# EAGLE design Qduino_Mini (EAGLE 7.3.0)
DESIGNER: Quin from Qtechknow; VERSION: v02
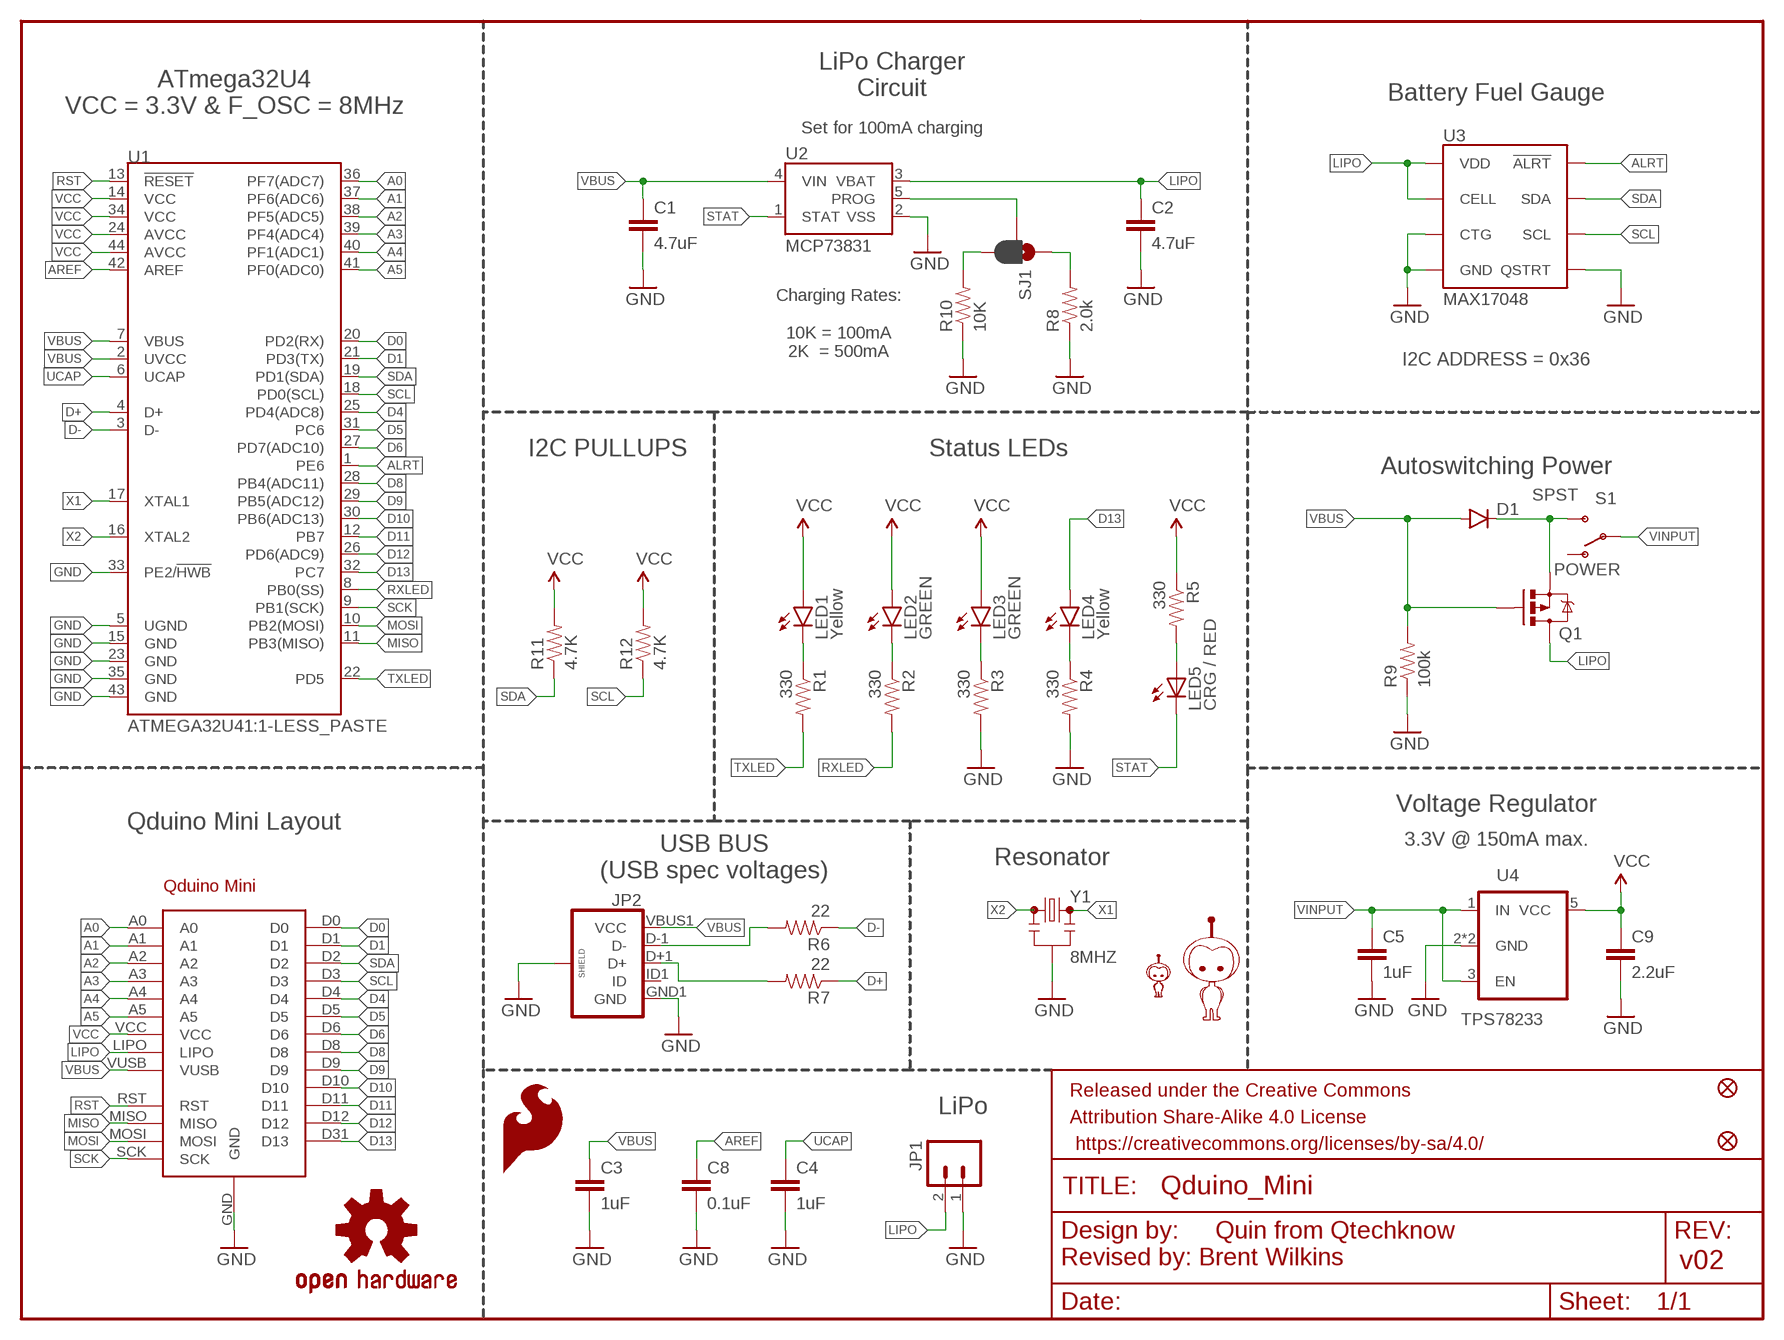
[diagram p0: schematic, sheet 1]

## Parts
C1  4.7uF  CAP0603-CAP  [0603-CAP]
C2  4.7uF  CAP0603-CAP  [0603-CAP]
C3  1uF  CAP0603-CAP  [0603-CAP]
C4  1uF  CAP0603-CAP  [0603-CAP]
C5  1uF  CAP0603-CAP  [0603-CAP]
C8  0.1uF  0.1UF-25V(+80/-20%)(0603)  [0603-CAP]
C9  2.2uF  2.2UF-10V-20%(0603)  [0603-CAP]
D1  250mA/100V  DIODEBAS16  [SOD-323]
FID5  FIDUCIAL1X2  [FIDUCIAL-1X2]
FID6  FIDUCIAL1X2  [FIDUCIAL-1X2]
FRAME2  FRAME-LETTER  [CREATIVE_COMMONS]
JP1  LiPo  M02-JST-2MM-SMT  [JST-2-SMD]
JP2  USB_MICROB_PLUGCONN-11752  [USB-B-MICRO-SMD_V03]
LED1  Yellow  LED-YELLOW0603  [LED-0603]
LED2  GREEN  LED-GREEN0603  [LED-0603]
LED3  GREEN  LED-GREEN0603  [LED-0603]
LED4  Yellow  LED-YELLOW0603  [LED-0603]
LED5  CRG / RED  LED0603  [LED-0603]
LOGO1  OSHW-LOGOS  [OSHW-LOGO-S]
LOGO2  SFE_LOGO_FLAME.1_INCH  [SFE_LOGO_FLAME_.1]
Q1  PFET  MOSFET-PCHANNEL  [SOT23-3]
R1  330  RESISTOR0603  [0603-RES]
R2  330  RESISTOR0603  [0603-RES]
R3  330  RESISTOR0603  [0603-RES]
R4  330  RESISTOR0603  [0603-RES]
R5  330  RESISTOR0603  [0603-RES]
R6  22  RESISTOR0603  [0603-RES]
R7  22  RESISTOR0603  [0603-RES]
R8  2.0k  2.0KOHM1/10W5%(0603)  [0603-RES]
R9  100k  100KOHM-1/10W-1%(0603)  [0603-RES]
R10  10K  10KOHM-1/10W-1%(0603)0603  [0603-RES]
R11  4.7K  RESISTOR0603-RES  [0603-RES]
R12  4.7K  RESISTOR0603-RES  [0603-RES]
S1  POWER  SWITCH-SPDT-SMD-A  [SWITCH-SPST-SMD-A]
SJ1  JUMPER-PAD-3-2OF3_NC_BY_PASTE  [PAD-JUMPER-3-2OF3_NC_BY_PASTE_YES_SILK_FULL_BOX]
U1  ATMEGA32U41:1-LESS_PASTE  [QFN-44-NOPAD_1:1-LESS_PASTE]
U2  MCP73831  [SOT23-5]
U3  MAX17048  MAX17048DFN8  [DFN-8]
U4  TPS78233  LDO-TPS78233  [SOT23-5]
U5  MIGHTYQ-L-SILK  [LOGO-LARGE-SILK]
U6  MIGHTYQ-S-SILK  [LOGO-SMALL-SILK]
U7  DNP  QDUINOMINI  [QDUINO_MINI_V15]
Y1  8MHZ  RESONATOR8MHZ  [RESONATOR-SMD]

## Nets
A0: U1.36(PF7(ADC7)) U7.A0
A1: U1.37(PF6(ADC6)) U7.A1
A2: U1.38(PF5(ADC5)) U7.A2
A3: U1.39(PF4(ADC4)) U7.A3
A4: U1.40(PF1(ADC1)) U7.A4
A5: U1.41(PF0(ADC0)) U7.A5
ALRT: U1.1(PE6) U3.P$5(!ALRT)
AREF: C8.1 U1.42(AREF)
D0: U1.20(PD2(RX)) U7.D0
D1: U1.21(PD3(TX)) U7.D1
D4: U1.25(PD4(ADC8)) U7.D4
D5: U1.31(PC6) U7.D5
D6: U1.27(PD7(ADC10)) U7.D6
D8: U1.28(PB4(ADC11)) U7.D8
D9: U1.29(PB5(ADC12)) U7.D9
D10: U1.30(PB6(ADC13)) U7.D10
D11: U1.12(PB7) U7.D11
D12: U1.26(PD6(ADC9)) U7.D12
D13: LED4.A U1.32(PC7) U7.D31(D13)
D+: R7.1 U1.4(D+)
D-: R6.1 U1.3(D-)
GND: C1.2 C2.2 C3.2 C4.2 C5.2 C8.2 C9.2 JP1.1 JP2.GND1(GND) JP2.SHIELD1(SHIELD) JP2.SHIELD2(SHIELD) JP2.SHIELD3(SHIELD) R3.2 R4.2 R8.1 R9.1 R10.1 U1.5(UGND) U1.15(GND) U1.23(GND) U1.33(PE2/!HWB) U1.35(GND) U1.43(GND) U2.2(VSS) U3.P$1(CTG) U3.P$4(GND) U3.P$6(QSTRT) U3.P$9(GND) U4.2(GND) U4.4(GND) U7.GND Y1.2
INMOSFET: D1.C Q1.2(S) S1.3(S)
LIPO: C2.1 JP1.2 Q1.3(D) U2.3(VBAT) U3.P$2(CELL) U3.P$3(VDD) U7.LIPO
MISO: U1.11(PB3(MISO)) U7.MISO
MOSI: U1.10(PB2(MOSI)) U7.MOSI
N$1: LED1.C R1.1
N$2: LED2.C R2.1
N$4: LED5.A R5.2
N$5: LED4.C R4.1
N$6: R10.2 SJ1.3
N$7: R8.2 SJ1.1
N$12: LED3.C R3.1
PROG: SJ1.2 U2.5(PROG)
RST: U1.13(!RESET) U7.RST
RXLED: R2.2 U1.8(PB0(SS))
SCK: U1.9(PB1(SCK)) U7.SCK
SCL: R12.1 U1.18(PD0(SCL)) U3.P$7(SCL) U7.D3
SDA: R11.1 U1.19(PD1(SDA)) U3.P$8(SDA) U7.D2
STAT: LED5.C U2.1(STAT)
TXLED: R1.2 U1.22(PD5)
UCAP: C4.1 U1.6(UCAP)
UD+: JP2.D+1(D+) R7.2
UD-: JP2.D-1(D-) R6.2
VBUS: C1.1 C3.1 D1.A JP2.VBUS1(VCC) Q1.1(G) R9.2 U1.2(UVCC) U1.7(VBUS) U2.4(VIN) U7.VUSB
VCC: C9.1 LED1.A LED2.A LED3.A R5.1 R11.2 R12.2 U1.14(VCC) U1.24(AVCC) U1.34(VCC) U1.44(AVCC) U4.5(VCC) U7.VCC
VINPUT: C5.1 S1.2(P) U4.1(IN) U4.3(EN)
X1: U1.17(XTAL1) Y1.3
X2: U1.16(XTAL2) Y1.1
Unconnected: JP2.ID1(ID) S1.1(O)

## Notes on the sheet
- LiPo Charger
  Circuit
- ATmega32U4
  VCC = 3.3V & F_OSC = 8MHz
- Battery Fuel Gauge
- Set for 100mA charging
- Charging Rates:
  
  10K = 100mA
  2K  = 500mA
- I2C ADDRESS = 0x36
- I2C PULLUPS | Status LEDs
- Autoswitching Power
- SPST
- Voltage Regulator
- Qduino Mini Layout
- 3.3V @ 150mA max.
- USB BUS
  (USB spec voltages)
- Resonator
- Revised by: Brent Wilkins

## Library data of the parts
C1 C2 = SparkFun-Passives:CAP: Capacitor Standard 0603 ceramic capacitor, and 0.1" leaded capacitor.; PROD_ID: CAP-10300
C3-C5 = SparkFun-Passives:CAP: Capacitor Standard 0603 ceramic capacitor, and 0.1" leaded capacitor.; PROD_ID: CAP-00868
C8 = SparkFun-Capacitors:0.1UF-25V(+80/-20%)(0603): CAP-00810 Ceramic Standard decoupling cap; PROD_ID: CAP-00810
C9 = SparkFun-Capacitors:2.2UF-10V-20%(0603): CAP-07888; PROD_ID: CAP-07888
D1 = SparkFun-DiscreteSemi:DIODE: Diode These are standard reverse protection diodes and small signal diodes. SMA package can handle up to about 1A. SOD-323 can handle about 200mA. What the SOD-323 package when ordering, there are some mfgs out there that are 5-pin packages.; PROD_ID: DIO-09646
FID5 FID6 = SparkFun-Aesthetics:FIDUCIAL: Fiducial Alignment Points Various fiducial points for machine vision alignment.
FRAME2 = SparkFun-Aesthetics:FRAME-LETTER: Schematic Frame Standard 8.5x11 US Letter frame; DESIGNER: NAME; VERSION: v01
JP1 = SparkFun:M02: Header 2 Standard 2-pin 0.1" header. Use with straight break away headers (SKU : PRT-00116), right angle break away headers (PRT-00553), swiss pins (PRT-00743), machine pins (PRT-00117), and female headers (PRT-00115). Molex polarized connector foot print use with SKU : PRT-08233 with associated crimp pins and housings.; PROD_ID: CONN-11443
JP2 = SparkFun-Connectors:USB_MICROB_PLUG: USB Micro-B connectors Some male, some female. Watch your step!; PROD_ID: CONN-11752
LED1 LED4 = SparkFun-LED:LED-YELLOW: Yellow SMD LEDs LilyPad 1206- DIO-09909 0603- DIO-09003 "SMART" means more efficient and expensive; PROD_ID: DIO-09003
LED2 LED3 = SparkFun-LED:LED-GREEN: Various green LEDs Green LEDs used in SFE Production 0603- DIO-00821 LARGE- DIO-00862 LILYPAD- DIO-09910; PROD_ID: DIO-00821
LED5 = SparkFun:LED: LEDs Standard schematic elements and footprints for 5mm, 3mm, 1206, and 0603 sized LEDs. 5mm - Spark Fun Electronics SKU : COM-00529 (and others); PROD_ID: DIO-00819
LOGO1 = SparkFun-Aesthetics:OSHW-LOGO: Open Source Hardware Logo This logo indicates the piece of hardware it is found on incorporates a OSHW license and/or adheres to the definition of open source hardware found here: http://freedomdefined.org/OSHW
LOGO2 = SparkFun-Aesthetics:SFE_LOGO_FLAME: SFE Logo, flame only This is the SparkFun flame logo. The logo on the schematic will always be the same size; the package variant is the height of the flame. Default layer for the logo on the board is tSilk.
Q1 = SparkFun-DiscreteSemi:MOSFET-PCHANNEL: Generic PMOSFET IRLML2244 - TRANS-11153 (SOT-23 -20V -4.3A) (1.Gate 2.Source 3.Drain) FQP27P06 - COM-10349 <http://www.sparkfun.com/products/10349> (TO-220 -60V -27A) (1.Gate 2.Source 3.Drain); PROD_ID: TRANS-08285
R1-R5 = SparkFun-Resistors:RESISTOR: Resistor Basic schematic elements and footprints for 0603, 1206, and PTH resistors.; PROD_ID: RES-00818
R6 R7 = SparkFun-Resistors:RESISTOR: Resistor Basic schematic elements and footprints for 0603, 1206, and PTH resistors.; PROD_ID: RES-08698
R8 = SparkFun-Resistors:2.0KOHM1/10W5%(0603): RES-08296; PROD_ID: RES-08296
R9 = SparkFun-Resistors:100KOHM-1/10W-1%(0603): RES-07828; PROD_ID: RES-07828
R10 = SparkFun-Resistors:10KOHM-1/10W-1%(0603): RES-00824; PROD_ID: RES-00824
R11 R12 = SparkFun-Passives:RESISTOR: Resistor Basic schematic elements and footprints for 0603, 1206, and PTH resistors.; PROD_ID: RES-07857
S1 = SparkFun-Electromechanical:SWITCH-SPDT: SPDT Switch Simple slide switch, Spark Fun Electronics SKU : COM-00102 DPDT SMT slide switch, AYZ0202, SWCH-08179; PROD_ID: SWCH-10651
SJ1 = SparkFun-Passives:JUMPER-PAD-3-2OF3_NC_BY_PASTE
U1 = SparkFun-DigitalIC:ATMEGA32U4: Atmel 44-pin 8-bit Microcontroller with 32KBytes of ISP Flash and USB Controller; PROD_ID: IC-10828
U2 = SparkFun:MCP73831: Microchip's MCP73831 Miniature single cell, fully integrated Li-Ion, Li-polymer charge management controller http://ww1.microchip.com/downloads/en/DeviceDoc/21984a.pdf; PROD_ID: IC-09995
U3 = SparkFun-DigitalIC:MAX17048: Micropower 1-Cell Li+ ModelGauge; PROD_ID: IC-12551
U4 = SparkFun-PowerIC:LDO-TPS78233: Voltage Regulator LDO 500nA Ground Current, 150mA, Ultra-Low Quiescent Current Low-Dropout Linear Regulator.; PROD_ID: IC-12550
U5 = SparkFun-Aesthetics:MIGHTYQ-L-SILK
U6 = SparkFun-Aesthetics:MIGHTYQ-S-SILK
U7 = SparkFun-Aesthetics:QDUINOMINI
Y1 = SparkFun-FreqCtrl:RESONATOR: Resonator Small SMD resonator. Used, eg, on the Arduino Pro/ Pro Mini boards. 8MHz- XTAL-08895 16MHz- XTAL-08900; PROD_ID: XTAL-08895

## Net classes
2 gnd: width 0.254 mm, drill 0.61 mm, clearance 0.254 mm

## Board
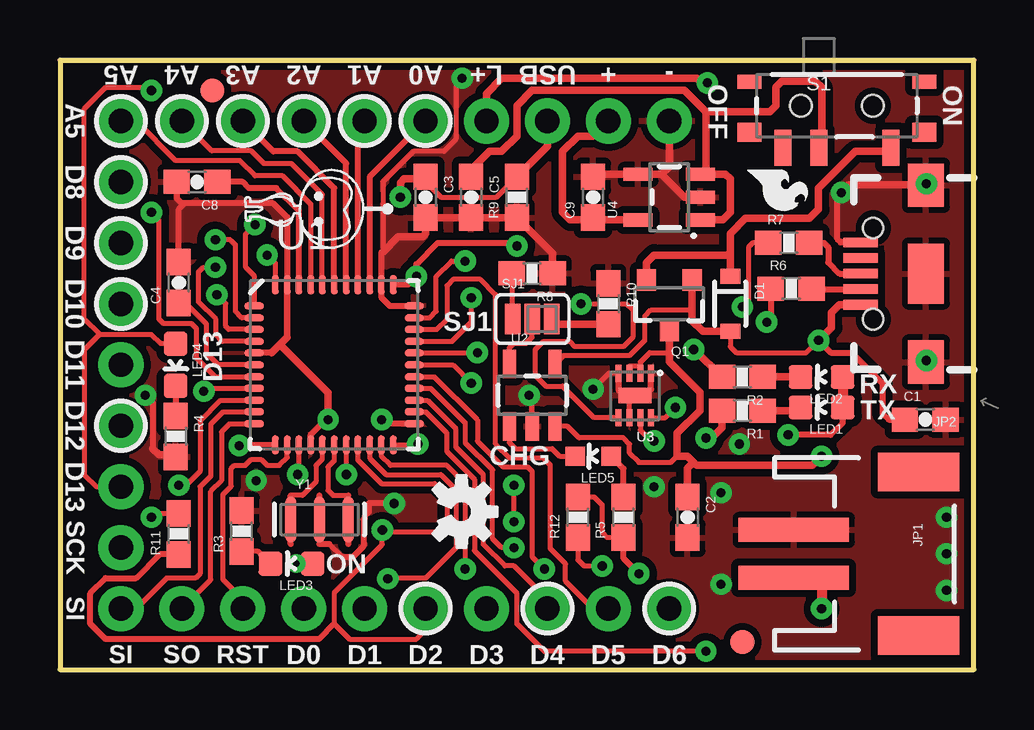
[diagram p1: board, top side]
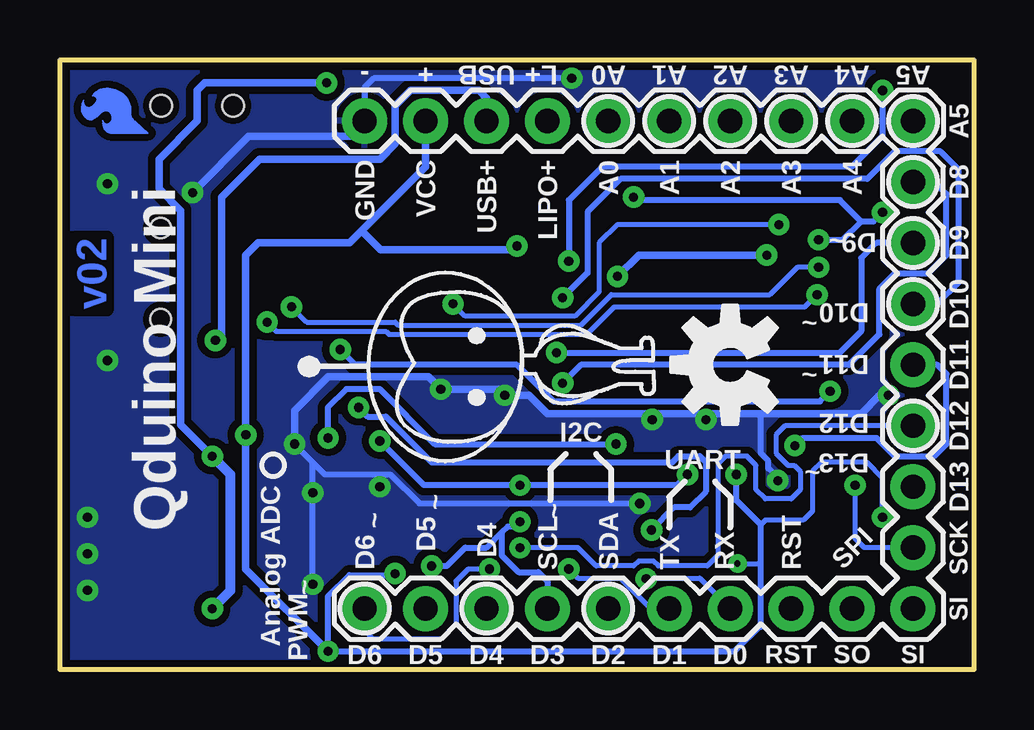
[diagram p2: board, bottom side, seen from below]

Size 38.1 x 25.4 mm. Coordinates in mm from the lower left corner, seen from the top.
Outline: 0,25.4 0,0 38.1,0 38.1,25.4 0,25.4
Copper layers (1*16): Top 0.035mm / dielectric 1.5mm / Bottom 0.035mm
Design rules "SparkFun-2-layer *": minimum track width 7mil, minimum drill 15mil, track to track 7mil, track to pad 7mil, pad to pad 7mil, via to via 7mil, smd to smd 7mil, copper to edge 8mil, drill to drill 8mil, minimum pad ring 12mil, minimum via ring 10mil, stop-mask expansion 4mil, vias tented up to drill 20mil, thermal gap 10mil

### Footprints (pad centres in the part's own frame; a part is rotated, then mirrored left to right if it is on the bottom)
0603-CAP = smd 1.1 x 1: 1 -0.85,0; 2 0.85,0
SOD-323 = smd 0.63 x 0.83: A 1.15,0; C -1.15,0
FIDUCIAL-1X2 = smd 1 x 1: 1 0,0
JST-2-SMD = smd 1 x 4.6: 1 -1,-3.7; 2 1,-3.7 | smd 1.6 x 3.4: NC1 -3.4,1.5; NC2 3.4,1.5
USB-B-MICRO-SMD_V03 = smd 1.45 x 0.4: D+1 2.725,0; D-1 2.725,0.65; GND1 2.725,-1.3; ID1 2.725,-0.65; VBUS1 2.725,1.3 | smd 1.5 x 1.8: SHIELD1 0,3.685; SHIELD2 0,-3.685 | smd 1.5 x 2.5: SHIELD3 0,0 | hole 0.85: 2.2,1.9; 2.2,-1.9
LED-0603 = smd 1 x 1: A 0,-0.877; C 0,0.877
LED-0603' = smd 0.8 x 0.8: A 0,-0.75; C 0,0.75
SOT23-3 = smd 0.8 x 0.9: 1 -0.95,-1; 2 0.95,-1; 3 0,1.1
0603-RES = smd 1.1 x 1: 1 -0.85,0; 2 0.85,0
SWITCH-SPST-SMD-A = smd 0.7 x 1.5: 1 -2.25,-1.75; 2 -0.75,-1.75; 3 2.25,-1.75 | smd 1 x 0.6: GND1 -3.65,1; GND3 3.65,1 | smd 1 x 0.8: GND2 -3.65,-1.1; GND4 3.65,-1.1 | hole 0.9: -1.5,0; 1.5,0
PAD-JUMPER-3-2OF3_NC_BY_PASTE_YES_SILK_FULL_BOX = smd 0.635 x 1.27: 1 -0.813,0; 2 0,0; 3 0.813,0
QFN-44-NOPAD_1:1-LESS_PASTE = smd 0.8 x 0.3: 1 -3.337,2.458; 2 -3.337,1.958; 3 -3.337,1.479; 4 -3.337,0.979; 5 -3.337,0.5; 6 -3.337,0; 7 -3.337,-0.5; 8 -3.337,-0.979; 9 -3.337,-1.479; 10 -3.337,-1.958; 11 -3.337,-2.458; 23 3.337,-2.458; 24 3.337,-1.958; 25 3.337,-1.479; 26 3.337,-0.979; 27 3.337,-0.5; 28 3.337,0; 29 3.337,0.5; 30 3.337,0.979; 31 3.337,1.479; 32 3.337,1.958; 33 3.337,2.458 | smd 0.3 x 0.8: 12 -2.458,-3.337; 13 -1.958,-3.337; 14 -1.479,-3.337; 15 -0.979,-3.337; 16 -0.5,-3.337; 17 0,-3.337; 18 0.5,-3.337; 19 0.979,-3.337; 20 1.479,-3.337; 21 1.958,-3.337; 22 2.458,-3.337; 34 2.458,3.337; 35 1.958,3.337; 36 1.479,3.337; 37 0.979,3.337; 38 0.5,3.337; 39 0,3.337; 40 -0.5,3.337; 41 -0.979,3.337; 42 -1.479,3.337; 43 -1.958,3.337; 44 -2.458,3.337
SOT23-5 = smd 0.55 x 1.2: 1 -0.95,-1.3; 2 0,-1.3; 3 0.95,-1.3; 4 0.95,1.3; 5 -0.95,1.3
DFN-8 = smd 0.25 x 0.7: P$1 -0.688,-0.92; P$2 -0.238,-0.92; P$3 0.212,-0.92; P$4 0.662,-0.92; P$5 0.662,0.93; P$6 0.212,0.93; P$7 -0.238,0.93; P$8 -0.688,0.93 | smd 1.37 x 0.64: P$9 -0.013,0.005
QDUINO_MINI_V15 = drill 1.016 pad 1.88: A0 -3.81,10.16; A1 -6.35,10.16; A2 -8.89,10.16; A3 -11.43,10.16; A4 -13.97,10.16; A5 -16.51,10.16; D0 -8.89,-10.16; D1 -6.35,-10.16; D2 -3.81,-10.16; D3 -1.27,-10.16; D4 1.27,-10.16; D5 3.81,-10.16; D6 6.35,-10.16; D8 -16.51,7.62; D9 -16.51,5.08; D10 -16.51,2.54; D11 -16.51,0; D12 -16.51,-2.54; D31 -16.51,-5.08; GND 6.35,10.16; LIPO -1.27,10.16; MISO -13.97,-10.16; MOSI -16.51,-10.16; RST -11.43,-10.16; SCK -16.51,-7.62; VCC 3.81,10.16; VUSB 1.27,10.16
RESONATOR-SMD = smd 0.45 x 1.905: 1 -1.2,0; 2 0,0; 3 1.2,0

### Placement (x,y rotation side)
C1  36.07,10.41 0 top
C2  26.16,6.35 270 top
C3  15.24,19.68 270 top
C4  4.95,16.13 90 top
C5  17.14,19.68 270 top
C8  5.71,20.32 180 top
C9  22.23,19.68 90 top
D1  27.94,15.24 270 top
FID5  28.45,1.14 0 top
FID6  6.35,24.13 0 top
FRAME2  -15.57,-9.42 0 top  (outside the outline)
JP1  34.29,4.83 270 top
JP2  36.1,16.5 180 top
LED1  31.75,10.92 90 top
LED2  31.75,12.19 90 top
LED3  9.65,4.41 90 top
LED4  4.83,12.7 180 top
LED5  CRG / RED  [LED-0603']  22.23,8.89 90 top
LOGO1  16.74,6.58 270 top
LOGO2  28.3,21.13 270 top
Q1  25.4,15.24 180 top
R1  28.45,10.79 180 top
R2  28.45,12.19 180 top
R3  7.58,5.77 90 top
R4  4.83,9.72 270 top
R5  23.5,6.35 90 top
R6  30.48,15.88 0 top
R7  30.38,17.78 0 top
R8  19.68,16.51 180 top
R9  19.05,19.68 90 top
R10  22.86,15.24 270 top
R11  4.95,5.65 90 top
R12  21.59,6.35 90 top
S1  32.38,23.5 0 top
SJ1  19.68,14.61 0 top
U1  11.43,12.7 0 top
U2  19.68,11.43 0 top
U3  23.95,11.43 180 top
U4  25.4,19.68 90 top
U5  18.82,12.7 90 bottom
U6  10.03,19.18 270 top
U7  19.05,12.7 0 top
U$4  [OSHW-LOGO-M]  10.16,12.7 90 bottom
U$6  [SFE-LOGO-FLAME-COPPER]  34.42,22.35 90 bottom
Y1  10.82,6.25 0 top

### Tracks (layer width: path | path; a pad name or v marks a point on that pad's centre or on a via)
A0
  Top 0.254: U7.A0 12.91,20.53 U1.36
A1
  Top 0.254: U7.A1 12.41,22.57 U1.37
A2
  Top 0.254: U1.38 11.93,21.09 U7.A2
A3
  Top 0.254: U1.39 11.43,20.07 9.91,21.59 8.89,21.59 U7.A3
A4
  Top 0.203: U1.40 10.93,19.8 9.65,21.08 8.51,21.08 7.98,21.61 6.33,21.61 U7.A4
A5
  Top 0.203: U7.A5 3.17,22.86 4.83,21.21 7.49,21.21 8.13,20.57 9.27,20.57 10.45,19.39 U1.41
ALRT  (via drill 0.38)
  Top 0.203: U3.P$5 22.27,10.5 20.95,11.81 20.26,11.81 19.81,12.26 19.81,13.34 20.13,13.65 21.27,13.65 21.46,13.46 23.5,13.46 23.88,13.84 23.88,14.99 23.62,15.24 v21.72,15.24 | v8.13,18.54 7.75,18.16 7.75,16.76 8.09,16.42 U1.1
  Bottom 0.203: v8.13,18.54 14.86,18.54 15.62,17.78 15.62,15.75 16.64,14.73 21.21,14.73 v21.72,15.24
AREF
  Top 0.254: 6.99,20.32 C8.1 7.62,20.32 7.87,20.07 9.02,20.07 9.95,19.13 U1.42
D0  (via drill 0.38)
  Top 0.203: U1.20 12.91,8.81 13.59,8.13 15.88,8.13 16.51,7.49 16.51,5.08 15.24,3.81 13.69,3.81 v13.66,3.79
  Bottom 0.203: U7.D0 11.43,3.81 13.64,3.81 v13.66,3.79
D1  (via drill 0.38)
  Top 0.203: v16.89,4.19 16.89,7.75 16.13,8.51 13.77,8.51 13.39,8.89 U1.21
  Bottom 0.203: v16.89,4.19 16.51,3.81 14.73,3.81 13.46,2.54 U7.D1
D4
  Top 0.203: U7.D4 20.32,2.92 18.92,4.32 18.54,4.32 17.65,5.21 17.65,8.13 16.51,9.27 16.51,10.03 15.32,11.22 U1.25
D5
  Top 0.203: U7.D5 22.23,2.54 21.08,3.68 21.08,4.4 20.45,5.04 20.45,8.51 20.13,8.83 18.73,8.83 18.16,9.4 18.16,15.62 17.53,16.26 16.38,16.26 16.13,16 16.13,14.61 15.7,14.18 U1.31
D6  (via drill 0.38)
  Top 0.203: U1.27 15.6,12.2 17.4,10.4 17.4,9.53 18.48,8.45 19.49,8.45 19.68,8.26 19.68,4.7 v20.19,4.19
  Bottom 0.203: v20.19,4.19 21.08,4.19 21.59,3.68 21.59,1.91 22.23,1.27 25.02,1.27 25.4,1.65 U7.D6
D8  (via drill 0.38)
  Top 0.203: U1.28 16.38,12.7 v17.14,11.94
  Bottom 0.254: v17.14,11.94 16.38,12.7 5.21,12.7 3.94,13.97 3.94,15.88 3.3,16.51 1.91,16.51 1.14,17.27 1.14,19.81 1.65,20.32 U7.D8
D9  (via drill 0.38)
  Top 0.203: U1.29 v17.41,13.2 v17.4,13.21
  Bottom 0.254: v17.4,13.21 5.59,13.21 4.7,14.1 4.7,17.14 4.06,17.78 U7.D9
D10  (via drill 0.38)
  Top 0.203: v17.14,15.49 17.14,14.48 16.35,13.68 U1.30
  Bottom 0.254: U7.D10 1.52,15.24 0.64,16.13 0.64,20.83 1.4,21.59 3.3,21.59 4.45,20.45 14.73,20.45 16.1,19.07 16.1,16.54 v17.14,15.49
D11  (via drill 0.38)
  Top 0.203: U1.12 7.5,9.36 v7.47,9.34
  Bottom 0.254: v7.47,9.34 7.15,9.65 4.06,9.65 3.3,8.89 1.65,8.89 1.14,9.4 1.14,12.32 1.52,12.7 U7.D11
D12  (via drill 0.38)
  Top 0.203: v18.92,5.08 18.41,5.08 18.03,5.46 18.03,8.32 16.89,9.46 16.89,10.29 15.46,11.72 U1.26
  Bottom 0.203: v18.92,5.08 16.51,5.08 15.75,4.32 14.17,4.32 13.97,4.52 13.36,4.52 13.16,4.32 11.11,4.32 10.67,4.76 10.67,8.57 10.35,8.89 9.46,8.89 9.08,8.51 9.08,7.49 8.7,7.11 7.62,7.11 7.24,7.49 7.24,8.26 7.49,8.51 7.75,8.51 8.26,9.02 8.26,9.78 7.87,10.16 U7.D12
D13  (via drill 0.38)
  Top 0.203: 1.65,13.97 1.02,13.34 1.02,8.13 1.52,7.62 U7.D31 | 1.65,13.97 3.81,13.97 4.19,13.59 4.81,13.59 LED4.A | 1.65,13.97 1.02,14.61 1.02,23.37 1.91,24.26 3.68,24.26 v3.81,24.13 | v16.89,17.02 16.32,17.02 15.68,16.38 15.68,14.92 15.42,14.66 U1.32
  Bottom 0.254: v3.81,24.13 3.81,22.23 5.08,20.95 15.49,20.95 16.89,19.56 v16.89,17.02
D+  (via drill 0.38)
  Top 0.203: v6.48,16.76 5.97,16.76 5.78,16.57 5.78,15.32 6.5,14.59 6.5,13.95 6.77,13.68 U1.4 | R7.1 28.88,17.78 28.7,17.6 28.7,15.37 v28.45,15.11
  Bottom 0.203: v6.48,16.76 7.37,16.76 8.51,15.62 15.11,15.62 16.38,14.35 24,14.35 24.13,14.48 27.81,14.48 v28.45,15.11
D-  (via drill 0.38)
  Top 0.203: v6.54,15.62 6.91,15.25 6.91,14.3 7.03,14.18 U1.3 | R6.1 29.63,15.66
  Top 0.254: 29.63,15.66 29.63,14.64 v29.46,14.48
  Bottom 0.203: v29.46,14.48 29.08,14.1 24.51,14.1 24.38,13.97 16.13,13.97 14.99,15.11 7.05,15.11 v6.54,15.62
GND  (via drill 0.38)
  Top 0.203: v16.76,24.64 16.64,24.64 16.51,24.51 16.51,22.1 16,21.59 14.73,21.59 13.46,20.32 13.46,17.4 | U3.P$4 22.89,12.35 v22.23,11.68 | U2.2 19.68,11.3 v19.56,11.43 | U3.P$6 23.74,11.43 U3.P$9 | 11.79,4.67 11.23,5.23
  Top 0.254: U3.P$9 23.96,11.39 23.75,11.18 | U3.P$1 24.64,11.68 24.38,11.43 U3.P$9 | U3.P$4 23.29,11.63 | U3.P$9 | 5.21,19.43 8.89,19.43 9.47,18.85 U1.43 | 5.21,19.43 5.08,19.43 4.87,19.65 C8.2 | 27.3,3.81 v27.56,3.56 | C4.2 4.95,19.18 5.21,19.43 | JP2.GND1 32.54,17.8 32.41,17.93 32.41,19.71 v32.58,19.88 | v13.93,6.92 12.87,6.92 12.87,6.57 12.7,6.4 12.7,6.3 12.65,6.25 12.65,5.13 12.19,4.67 11.79,4.67 | 13.43,17.37 13.39,17.32 U1.35 13.39,15.52 13.75,15.16 U1.33 | 8.83,13.2 U1.5 | U1.23 13.58,10.24 v13.41,10.41 | U1.15 10.45,9.79 11.07,10.41 v11.18,10.41 | 9.14,13.51 9.2,13.51 | v3.56,11.43 3.87,11.11 3.87,9.21 | 11.23,5.23 10.82,5.23
  Top 0.279: U1.43 9.47,13.84
  Top 0.305: 3.87,9.21 4.13,8.95 4.95,8.95 | 13.43,17.37 13.46,17.4 14.1,18.03 15.11,18.03 15.24,18.16 C3.2 C5.2 R9.1 20.54,17.35 R8.1 | v32.58,19.88 32.89,20.19 36.12,20.19 v36.12,20.24 | C9.2 22.32,20.64 U4.4 25.08,20.64 | 25.08,20.64 25.4,20.95 U7.GND | U4.2 26.03,19.68 25.08,20.64 | 9.47,13.84 9.14,13.51 8.83,13.2 | 9.2,13.51 11.18,11.53 v11.18,10.41
  Bottom 0.254: 27.56,8.64 v28.32,9.4 | v16.76,24.64 25.02,24.64 25.4,24.26 U7.GND | v13.93,6.92 23.11,6.92 24.32,8.13 27.05,8.13 27.56,8.64 | v27.56,3.56 27.56,8.64 | 8.13,7.94 8.57,8.38 8.57,8.7 8.89,9.02 8.89,10.6 8.83,10.67 | 13.41,10.67 13.36,10.62 13.41,10.57 v13.41,10.41 | 10.97,10.67 10.97,10.26 11.02,10.26 v11.18,10.41
  Bottom 0.305: v28.32,9.4 28.32,10.79 26.92,12.19 22.73,12.19 v22.23,11.68 19.81,11.68 v19.56,11.43 18.54,11.43 17.78,10.67 13.41,10.67 10.97,10.67 8.83,10.67 4.7,10.67 3.94,11.43 v3.56,11.43 | v32.58,19.88 30.23,22.23 26.04,22.23 U7.GND
  other vias: 8.18,7.87 36.12,12.88 36.96,3.3 36.96,4.83 36.96,6.35 24.77,7.62 27.56,7.37
  pour Bottom (isolate 0.305): 0,25.4 38.1,25.4 38.1,0 0,0
  pour Top (isolate 0.305): 0,25.4 38.1,25.4 38.1,0 0,0
INMOSFET
  Top 0.305: D1.C 27.94,17.4 | 27.94,17.4 27.94,18.16 28.57,18.8 31.24,18.8 31.62,19.18 31.62,20.07 33.15,21.59 34.48,21.59 S1.3 34.54,21.65 | Q1.2 24.45,16.96 24.77,17.27 27.81,17.27 27.94,17.4
LIPO  (via drill 0.38)
  Top 0.203: U3.P$3 23.74,12.65 24.19,12.65 | 25.4,13.21 24.59,13.21 24.19,12.81 U3.P$2 | 25.72,8.89 25.46,8.64 24.13,8.64 23.75,9.02 23.75,9.4 23.5,9.65 21.64,9.65 21.16,10.13 U2.3 | U3.P$2 | 24.21,12.65 24.19,12.65 | 24.19,12.65 U3.P$2
  Top 0.305: v26.99,24.45 26.73,24.45 26.54,24.64 18.41,24.64 17.78,24 U7.LIPO | Q1.3 25.4,13.21 25.4,12.83 26.67,11.56 26.67,10.79 25.72,9.84 25.72,8.89 26.16,8.89 26.42,8.64 | 26.42,8.64 26.54,8.51 31.37,8.51 v31.75,8.89 | JP1.2 30.35,4.06 28.7,4.06 28.96,3.81 31.75,3.81 | C2.1 26.16,8.38 26.42,8.64
  Top 0.406: 31.75,3.81 v31.75,2.54
  Bottom 0.305: v26.99,24.45 32.07,24.45 32.38,24.13 32.38,22.86 33.97,21.27 33.97,20.03 33.07,19.13 33.07,10.21 v31.75,8.89
  Bottom 0.406: v31.75,2.54 30.99,3.3 30.99,8.13 v31.75,8.89
MISO
  Top 0.203: U7.MISO 6.29,3.75 6.29,7.43 6.73,7.87 6.73,9.91 7.07,10.24 U1.11
MOSI
  Top 0.203: U7.MOSI 3.17,2.54 4.45,3.81 5.65,3.81 5.84,4 5.84,7.62 6.29,8.06 6.29,10.22 6.8,10.74 U1.10
N$1
  Top 0.305: R1.1 30.75,10.79 LED1.C
N$2
  Top 0.305: LED2.C R2.1
N$3
  cutout Top: 8.64,15.14 8.64,15.49 8.94,15.49 14.22,15.49 14.22,9.96 14.22,9.91 8.64,9.91
N$4
  Top 0.203: LED5.A
  Top 0.254: R5.2 23.5,8.37 LED5.A
N$5
  Top 0.254: LED4.C 4.83,10.79
  Top 0.305: 4.83,10.79 R4.1
N$6
  Top 0.305: R10.2 20.71,14.39 SJ1.3
N$7
  Top 0.203: R8.2 18.84,14.64 SJ1.1
N$12
  Top 0.203: LED3.C 8.27,4.92 R3.1
PROG
  Top 0.203: U2.5 18.73,13.4 18.92,13.59 19.43,13.59 19.68,13.84 SJ1.2
RST
  Top 0.203: U7.RST 7.62,2.92 6.79,3.75 6.79,7.3 7.14,7.64 7.14,8.38 7.26,8.51 7.72,8.51 7.98,8.76 8.38,8.76 8.64,8.51 9.14,8.51 9.47,8.84 U1.13
RXLED  (via drill 0.38)
  Top 0.203: U1.8 6.12,11.72 v5.99,11.6
  Top 0.305: v26.42,13.34 26.45,13.34 R2.2
  Bottom 0.254: v5.99,11.6 6.41,11.18 17.53,11.18 19.05,12.7 25.78,12.7 v26.42,13.34
SCK  (via drill 0.38)
  Top 0.203: v4.95,7.68 5.27,7.68 5.84,8.26 5.84,10.38 6.69,11.22 U1.9
  Bottom 0.203: U7.SCK 4.57,5.08 4.95,5.46 v4.95,7.68
SCL  (via drill 0.38)
  Top 0.203: U1.18 v11.93,8.14 v11.94,8.13 | v18.92,6.16 v18.92,7.68 | U3.P$7 24.19,9.97 24.38,9.78 24.51,9.78 v24.77,9.53 | R12.1 21.59,4.57 21.84,4.32 v22.61,4.32
  Bottom 0.254: v11.94,8.13 12.38,7.68 v18.92,7.68 22.92,7.68 v24.77,9.53 | 19.68,5.71 19.43,5.97 19.11,5.97 v18.92,6.16 | 19.68,5.71 19.68,4.76 18.99,4.06 18.16,4.06 17.78,3.68 U7.D3 | v22.61,4.32 21.97,4.32 21.21,5.08 20.32,5.08 19.68,5.71
SDA  (via drill 0.38)
  Top 0.203: U3.P$8 25.23,10.5 v25.65,10.92 | U7.D2 15.24,1.65 14.86,1.27 12.06,1.27 11.43,1.91 11.43,3.2 13.44,5.21 v13.44,5.82 13.54,5.71 16,5.71 16.13,5.84 16.13,7.24 15.62,7.75 13.4,7.75 12.41,8.74 U1.19
  Top 0.254: 11.43,1.91 10.79,1.27 1.91,1.27 1.27,1.91 1.27,3.17 1.91,3.81 3.17,3.81 4.17,4.8 R11.1
  Bottom 0.254: v25.65,10.92 25.27,10.54 24.51,10.54 22.61,8.64 12.57,8.64 12.32,8.89 11.43,8.89 11.18,8.64 11.18,7.42 11.84,6.76 12.5,6.76 v13.44,5.82
STAT
  Top 0.203: U2.1 18.73,9.46 18.99,9.21 20.51,9.21 20.83,8.89 LED5.C
TXLED  (via drill 0.38)
  Top 0.203: U1.22 14.89,9.36 v14.92,9.4
  Top 0.305: R1.2 27.6,10.07 27.18,9.65 v26.92,9.65
  Bottom 0.254: v14.92,9.4 22.48,9.4 24.77,11.68 26.16,11.68 26.92,10.92 v26.92,9.65
UCAP
  Top 0.203: C4.1 5.22,15.28 6.1,14.4 6.1,13.21 6.6,12.7 U1.6
UD+
  Top 0.254: R7.2 31.85,17.78 32.03,17.6 32.03,16.97 32.5,16.5 JP2.D+1
UD-
  Top 0.254: R6.2 31.36,15.85 JP2.D-1
VBUS  (via drill 0.38)
  Top 0.203: C3.1 15.24,20.32 15.88,19.68 18.2,19.68 R9.2 | v3.81,19.05 4.13,18.73 4.13,14.61 4.32,14.41 5.49,14.41 5.69,14.21 5.69,12.98 6.47,12.2 U1.7 | 26.35,14.86 26.22,14.99 24.64,14.99 24.38,14.73 24.38,13.72 23.75,13.08 20.99,13.08 U2.4 | v6.48,17.91 7.11,17.91 7.11,17.89 7.32,17.69 7.32,14.92 7.58,14.66 U1.2 | D1.A 27.94,13.46 28.19,13.21 31.11,13.21 v31.62,13.72
  Top 0.254: 15.15,20.45 C3.1 | R9.2 19.05,20.57 20.32,21.84 | v31.62,13.72 32.13,13.21 33.02,13.21 34.29,11.94 34.29,10.67 34.54,10.41 C1.1
  Top 0.305: R9.2 20.32,21.8 20.32,21.84 U7.VUSB | 15.15,20.45 14.35,20.45 14.19,20.29 v14.19,19.68 | D1.A 26.8,14.09 26.35,14.54 26.35,14.86 Q1.1 | v31.62,13.72 32.16,14.25 32.16,14.86 32.5,15.2 JP2.VBUS1
  Bottom 0.254: v3.81,19.05 4.19,18.67 4.7,18.67 | 4.7,18.67 5.59,19.56 14.06,19.56 v14.19,19.68 | v6.48,17.91 5.46,17.91 4.7,18.67
  Bottom 0.305: v31.62,13.72 31.37,13.97 31.37,19.68 29.78,21.27 24.77,21.27 24.13,21.91 24.13,23.5 23.5,24.13 20.64,24.13 20.32,23.81 U7.VUSB
VCC  (via drill 0.25, 0.38)
  Top 0.203: R12.2 22.26,7.2 22.61,6.86 22.61,5.71 22.82,5.5 R5.1 | R11.2 3.96,6.5 v3.81,6.35 | v26.92,0.76 20.19,0.76 19.05,1.91 19.05,3.17 17.27,4.95 17.27,7.94 16.13,9.08 16.13,9.86 15.24,10.74 U1.24 | U1.44 8.97,16.94 v8.64,17.27 | U1.14 9.95,8.17 v9.91,8.13 | LED3.A v9.86,4.42
  Top 0.254: v19.05,17.65 18.92,17.78 15.75,17.78 14.86,16.89 v14.86,16.38 14.51,16.04 U1.34 | R5.1 23.5,4.64 v24.13,4 | 32.63,10.78 LED1.A 32.63,10.28 32.13,9.78 v30.35,9.78
  Top 0.305: C9.1 22.32,18.73 U4.5 21.27,18.73 20.95,19.05 20.95,21.59 21.59,22.23 22.23,22.23 U7.VCC
  Top 0.406: LED2.A LED1.A
  Bottom 0.203: v3.81,6.35 3.81,8 4.45,8.64 6.35,8.64 6.73,8.26 6.73,6.6 7.11,6.22 8.7,6.22 8.89,6.03 | v9.86,4.42 8.99,4.42 8.89,4.32
  Bottom 0.254: v24.13,4 24.19,3.94 26.04,3.94 26.92,3.05 v26.92,0.76 9.98,0.76 8.89,1.85 | 8.89,1.78 8.89,1.85 | 8.89,1.85 8.89,4.32 8.89,6.03 9.91,7.05 v9.91,8.13
  Bottom 0.305: 25.53,18.29 22.86,20.95 U7.VCC | 25.53,18.29 26.04,17.78 29.84,17.78 30.35,17.27 v30.35,9.78 30.35,4.19 v26.92,0.76 | v8.64,17.27 13.97,17.27 v14.86,16.38 | v19.05,17.65 19.21,17.49 24.73,17.49 25.53,18.29
VINPUT
  Top 0.305: 26.92,23.24 26.04,24.13 19.68,24.13 19.05,23.5 19.05,22.23 18.41,21.59 17.91,21.59 17.14,20.83 C5.1 | U4.1 27.62,18.73 27.94,19.05 27.94,20.44 27.75,20.64 U4.3 26.92,20.86 26.92,23.24 | 26.92,23.24 29.59,23.24 29.84,23.5 29.84,24.26 30.1,24.51 31.5,24.51 31.75,24.26 31.75,21.86 S1.2
X1
  Top 0.203: U1.17 11.43,8.7 11.18,8.45 11.18,7.47 11.38,7.26 12.02,7.26
X2
  Top 0.203: U1.16 10.93,8.77 10.67,8.51 10.67,7.82 10.11,7.26 9.62,7.26

### Text on the board
tPlace: OFF | ON | SJ1 | D13 | RX | TX | CHG | ON
Measures: All units in inches
tDocu: Revised by: Brent Wilkins